# Altium schematic sheet P1.schdoc
size 297 x 209 mm; Symbol: Drawing-Symbol_A4; Company: 嘉立创EDA; Version: V1.0; Page Size: A4; @Project Name: Arduino Serial OLED Terminal_2026-07-03_17-05-52; @Page Count: 1; @Update Date: 2026-07-03; @Create Date: 2026-07-03; @Schematic Name: Schematic1; @Page No: 1; @Page Name: P1; @Board Name: Board1; @Create Time: 09:07:05; @Update Time: 17:07:05; Border: 1; Title Block Position: 3; Size: A4; Width: 1170; Height: 825; Region Start: 1; X Region Count: 6; Y Region Count: 4; Blade Width: 10; Device: Drawing-Symbol_A4
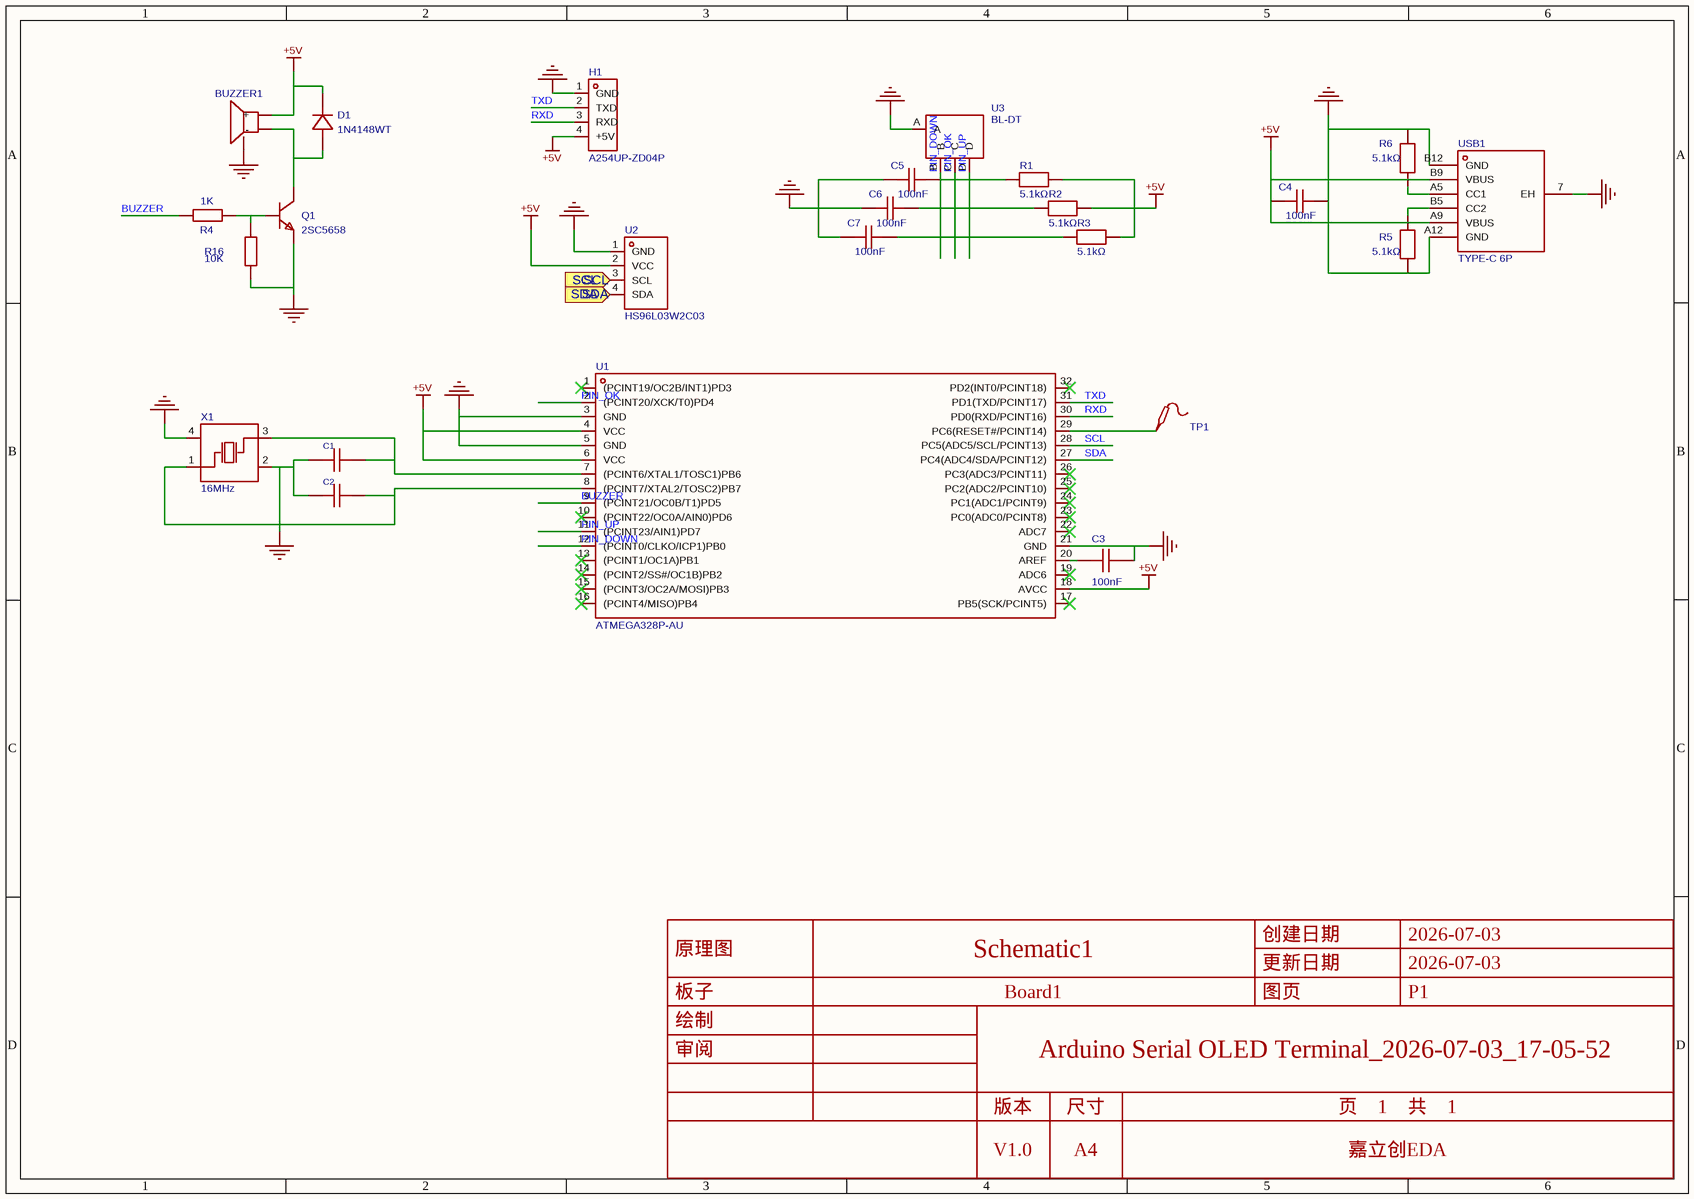
[diagram p0: P1.schdoc]

## Parts
BUZZER1  4kHz  [BUZ-SMD_L5.0-W5.5-P4.60]  (value not drawn)
C1  CL10C220JB8NNNC  [C0603]  (value not drawn)
C2  CL10C220JB8NNNC  [C0603]  (value not drawn)
C3  100nF  [C0603]
C4  100nF  [C0603]
C5  100nF  [C0603]
C6  100nF  [C0603]
C7  100nF  [C0603]
D1  1N4148WT  [SOD-523_L1.2-W0.8-LS1.6-FD]
H1  A254UP-ZD04P  [HDR-TH_A254UP-ZD04P]
Q1  2SC5658  [SOT-723_L1.2-W0.8-P0.80-LS1.2-BR]
R1  5.1kΩ  [R0603]
R2  5.1kΩ  [R0603]
R3  5.1kΩ  [R0603]
R4  1K  [R0402_无丝印]
R5  5.1kΩ  [R0603]
R6  5.1kΩ  [R0603]
R16  10K  [R0402_无丝印]
TP1  (no value)  [Test-Point-0.5mm]
U1  ATMEGA328P-AU  [TQFP-32_L7.0-W7.0-P0.80-LS9.0-BL]
U2  HS96L03W2C03  [OLED-TH_L27.8-W27.2-P2.54_C9900033791]
U3  BL-DT  [SW-SMD_BL-DT]
USB1  TYPE-C 6P  [TYPE-C-SMD_TYPE-C-6P_1]
X1  16MHz  [CRYSTAL-SMD_4P-L3.2-W2.5-BL]

## Ports
SCL (in), SDA (in)

## Nets
+5V: BUZZER1.1(+) C4.1 D1.2(C) H1.4(+5V) R1.2 R2.2 R3.2 U1.4(VCC) U1.6(VCC) U1.18(AVCC) U2.2(VCC) USB1.A9(VBUS) USB1.B9(VBUS)
GND: BUZZER1.3(NC) C1.1 C2.1 C3.2 C4.2 C5.1 C6.1 C7.1 H1.1(GND) Q1.2(E) R5.1 R6.2 R16.1 U1.3(GND) U1.5(GND) U1.21(GND) U2.1(GND) U3.A USB1.7(EH) USB1.A12(GND) USB1.B12(GND) X1.2(GND) X1.4(GND)
BUZZER: R4.1 U1.9((PCINT21/OC0B/T1)PD5)
PIN_DOWN: C5.2 R1.1 U1.12((PCINT0/CLKO/ICP1)PB0) U3.B
PIN_OK: C6.2 R2.1 U1.2((PCINT20/XCK/T0)PD4) U3.C
PIN_UP: C7.2 R3.1 U1.11((PCINT23/AIN1)PD7) U3.D
RXD: H1.3(RXD) U1.30(PD0(RXD/PCINT16))
SCL: U1.28(PC5(ADC5/SCL/PCINT13)) U2.3(SCL) ; port SCL
SDA: U1.27(PC4(ADC4/SDA/PCINT12)) U2.4(SDA) ; port SDA
TXD: H1.2(TXD) U1.31(PD1(TXD/PCINT17))
NetBUZZER1_2: BUZZER1.2(-) D1.1(A) Q1.3(C)
NetC1_2: C1.2 U1.7((PCINT6/XTAL1/TOSC1)PB6) X1.3(OSC2)
NetC2_2: C2.2 U1.8((PCINT7/XTAL2/TOSC2)PB7) X1.1(OSC1)
NetC3_1: C3.1 U1.20(AREF)
NetQ1_1: Q1.1(B) R4.2 R16.2
NetR5_2: R5.2 USB1.B5(CC2)
NetR6_1: R6.1 USB1.A5(CC1)
NetTP1_1: TP1.1 U1.29(PC6(RESET#/PCINT14))

Not connected (* = marked no-connect by the designer): U1 1((PCINT19/OC2B/INT1)PD3)* 10((PCINT22/OC0A/AIN0)PD6)* 13((PCINT1/OC1A)PB1)* 14((PCINT2/SS#/OC1B)PB2)* 15((PCINT3/OC2A/MOSI)PB3)* 16((PCINT4/MISO)PB4)* 17(PB5(SCK/PCINT5))* 19(ADC6)* 22(ADC7)* 23(PC0(ADC0/PCINT8))* 24(PC1(ADC1/PCINT9))* 25(PC2(ADC2/PCINT10))* 26(PC3(ADC3/PCINT11))* 32(PD2(INT0/PCINT18))*

## Notes on the sheet
- 创建日期
- 2026-07-03
- 原理图
- 板子
- Schematic1
- Board1
- 更新日期
- 图页
- P1
- 绘制
- 审阅
- Arduino Serial OLED Terminal_2026-07-03_17-05-52
- 版本
- V1.0
- 尺寸
- A4
- 页    1    共    1
- 嘉立创EDA

## Library data of the parts
BUZZER1 = MLT-5020: Manufacturer: 华能; Driver Circuitry: 无源(外部驱动); 3D Model: 0044e78390e14de39818311c3b0a8804; 3D Model Transform: 207.31557,204.724,0,270,0,0,-0.001,0.003,0; AddInBom: yes; ModelName: BUZ-SMD_3P-L5.2-W5.2-H2.0-P3.50; Symbol: MLT-5020; Device: MLT-5020; LCSC Part Name: MLT-5020; Supplier Part: C94598; Manufacturer Part: MLT-5020; Supplier Footprint: SMD,5x5mm; JLCPCB Part Class: 扩展库; Datasheet: https://atta.szlcsc.com/upload/public/pdf/source/20210811/111454390007D221D7259018FB170E62.pdf; Supplier: LCSC; Technology: 电磁式; Value: 4kHz; Length: 5.2mm; Width: 5.2mm; Height: 2.5mm; FootprintName: BUZ-SMD_L5.0-W5.5-P4.60; ConvertToPcb: yes
C1 C2 = CL10C220JB8NNNC: 容值:22pF;精度:±5%;额定电压:50V;温度系数:C0G;; Manufacturer: SAMSUNG(三星); AddInBom: yes; ModelId: ac125912035d415993ca9572d50418b1; ModelName: C0603_L1.6-W0.8-H0.8; ModelTransform: 62.992,31.496,0,0,0,0,0,0,0; Value: 22pF; Tolerance: ±5%; Voltage Rating: 50V; Temperature Coefficient: C0G; Device: CL10C220JB8NNNC; LCSC Part Name: 22pF ±5% 50V; SupplierPart: C1653; ManufacturerPart: CL10C220JB8NNNC; Supplier Footprint: 0603; JLCPCB Part Class: 基础库; Datasheet: https://item.szlcsc.com/datasheet/CL10C220JB8NNNC/2005.html; Supplier: LCSC; ConvertToPcb: yes; SymbolName: CL10C220JB8NNNC; FootprintName: C0603
C3 = FCC0603B104K500CT: 容值:100nF;精度:±10%;额定电压:50V;温度系数:X7R;; Manufacturer: FOJAN(富捷); AddInBom: yes; ModelId: ac125912035d415993ca9572d50418b1; ModelName: C0603_L1.6-W0.8-H0.8; ModelTransform: 62.992,31.496,0,0,0,0,0,0,0; Tolerance: ±10%; Voltage Rating: 50V; Temperature Coefficient: X7R; Symbol: FCC0603B104K500CT; Device: FCC0603B104K500CT; LCSC Part Name: 100nF ±10% 50V; SupplierPart: C5137636; ManufacturerPart: FCC0603B104K500CT; Supplier Footprint: 0603; JLCPCB Part Class: 扩展库; Datasheet: https://item.szlcsc.com/datasheet/FCC0603B104K500CT/5747088.html; Supplier: LCSC; ConvertToPcb: yes; FootprintName: C0603; Value: 100nF
C4-C7 = FCC0603B104K500CT: 容值:100nF;精度:±10%;额定电压:50V;温度系数:X7R;; Manufacturer: FOJAN(富捷); 3D Model: ac125912035d415993ca9572d50418b1; 3D Model Transform: 62.992,31.496,0,0,0,0,0,0,0; Tolerance: ±10%; Voltage Rating: 50V; Temperature Coefficient: X7R; AddInBom: yes; ModelName: C0603_L1.6-W0.8-H0.8; Symbol: FCC0603B104K500CT; Device: FCC0603B104K500CT; LCSC Part Name: 100nF ±10% 50V; Supplier Part: C5137636; Manufacturer Part: FCC0603B104K500CT; Supplier Footprint: 0603; JLCPCB Part Class: 扩展库; Datasheet: https://item.szlcsc.com/datasheet/FCC0603B104K500CT/5747088.html; Supplier: LCSC; Value: 100nF; ConvertToPcb: yes; FootprintName: C0603
D1 = 1N4148WT_C2961218: Manufacturer: CJ(江苏长电/长晶); Diode Configuration: 独立式; Forward Voltage (Vf@If): 1.25V@150mA; Reverse Voltage (Vr): 75V; Rectified Current: 150mA; Reverse Leakage Current (Ir): 1uA@75V; Reverse Recovery Time (trr): 4ns; 3D Model: 8f56a03db567494d8f4c9d12aa52a741; 3D Model Transform: 62.992,31.496,0,0,0,0,0,0,0; AddInBom: yes; ModelName: SOD-523_L1.2-W0.8-H0.7-LS1.6; Symbol: 1N4148WT_C2961218; Device: 1N4148WT_C2961218; LCSC Part Name: 1N4148WT; Supplier Part: C2961218; Manufacturer Part: 1N4148WT; Supplier Footprint: SOD-523; JLCPCB Part Class: 扩展库; Datasheet: https://atta.szlcsc.com/upload/public/pdf/source/20220119/078E246DE0AEC70DDF429D96EB20929E.pdf; Supplier: LCSC; Operating Temperature: -55℃~+150℃@(Tj); FootprintName: SOD-523_L1.2-W0.8-LS1.6-FD; ConvertToPcb: yes
H1 = A254UP-ZD04P: 插针结构:1x4P;间距:2.54mm;行距:-;圆针/方针:方针;安装方式:直插;排数:单排;总PIN位数:4P;额定电流:3A;配合针长度:6mm;塑高:2.5mm;触头材质:黄铜;触头镀层:金;工作温度:-40℃~+105℃;颜色:黑色;; Manufacturer: BXCONN(宝讯); AddInBom: yes; ModelId: 55ae819b25fc49c39c917541034744cf0819f05c4eef4c71ace90d822a990e87; ModelTransform: 400.3929,98.425,0,0,0,0,0,0,-118.11; Pin Structure: 1x4P; Pitch: 2.54mm; Circluar Pins/Square Pins: 方针; Current Rating: 3A; Symbol: A254UP-ZD04P; Device: A254UP-ZD04P; LCSC Part Name: 1x4P 间距:2.54mm 方针 直插; SupplierPart: C41413833; ManufacturerPart: A254UP-ZD04P; Supplier Footprint: 插件,P=2.54mm; JLCPCB Part Class: Extended Part; Datasheet: https://item.szlcsc.com/datasheet/A254UP-ZD04P/43230040.html; Supplier: LCSC; ConvertToPcb: yes; FootprintName: HDR-TH_A254UP-ZD04P; ModelName: HDR-TH_A254UP-ZD04P; Row Spacing: -; Mounting Type: 直插; Number of Rows: 单排; Number of Pins: 4P; Length of Mating Pin: 6mm; Insulation Height: 2.5mm; Contact Material: 黄铜; Contact Plating: 金; Operating Temperature: -40℃~+105℃; Color: 黑色
Q1 = 2SC5658: Manufacturer: CJ(江苏长电/长晶); type: NPN; Current - Collector(Ic): 150mA; Collector - Emitter Voltage VCEO: 50V; Pd - Power Dissipation: 100mW; DC Current Gain: 120@1mA,6V; Transition frequency(fT): 180MHz; Current - Collector Cutoff: 100nA; Vce Saturation(VCE(sat)): 400mV; 3D Model: 8f70d69c83f742259d42411b19cb5a39; 3D Model Transform: 47.244,47.244,0,0,0,0,0,0,0; AddInBom: yes; Symbol: 2SC5658; Device: 2SC5658; LCSC Part Name: 2SC5658; Supplier Part: C2991944; Manufacturer Part: 2SC5658; Supplier Footprint: SOT-723-3; JLCPCB Part Class: 扩展库; Datasheet: https://atta.szlcsc.com/upload/public/pdf/source/20220411/B0F88ECFC7B48FCE56684AE93078BF46.pdf; Supplier: LCSC; Operating Temperature: -55℃~+150℃; FootprintName: SOT-723_L1.2-W0.8-P0.80-LS1.2-BR; ConvertToPcb: yes; ModelName: SOT-723_L1.2-W0.8-P0.80-LS1.2-BR
R1-R3 = FRC0603F5101TS: 电阻类型:厚膜电阻;阻值:5.1kΩ;精度:±1%;功率:100mW;工作电压:75V;温度系数:±100ppm/℃;; Manufacturer: FOJAN(富捷); AddInBom: yes; ModelId: fc143cca1e79419f9cd78b61e9279f080819f05c4eef4c71ace90d822a990e87; ModelTransform: 31.8897,63.7794,0,90,0,0,0,0,0; Tolerance: ±1%; Power(Watts): 100mW; Voltage-Supply(Max): 75V; Symbol: FRC0603F5101TS; Device: FRC0603F5101TS; LCSC Part Name: 5.1kΩ ±1% 100mW 厚膜电阻; SupplierPart: C2907044; ManufacturerPart: FRC0603F5101TS; Supplier Footprint: 0603; JLCPCB Part Class: Extended Part; Supplier: LCSC; ConvertToPcb: yes; FootprintName: R0603; ModelName: R0603; Type: 厚膜电阻; Value: 5.1kΩ; Temperature Coefficient: ±100ppm/℃; Operating Temperature: -55℃~+155℃
R4 R16 = R0402_无丝印: 3D Model: 98c88bc2b9094f218f3a3e30a7012738; 3D Model Transform: 39.37,19.685,14.1732,0,0,0,1200.6299,272.6969,0; AddInBom: yes; ModelName: R0402_L1.0-W0.5-H0.4; Symbol: R0402_无丝印; Device: R0402_无丝印; FootprintName: R0402_无丝印; ConvertToPcb: yes
R5 R6 = FRC0603F5101TS: 电阻类型:厚膜电阻;阻值:5.1kΩ;精度:±1%;功率:100mW;工作电压:75V;温度系数:±100ppm/℃;; Manufacturer: FOJAN(富捷); 3D Model: fc143cca1e79419f9cd78b61e9279f080819f05c4eef4c71ace90d822a990e87; 3D Model Transform: 31.8897,63.7794,0,90,0,0,0,0,0; Tolerance: ±1%; Power(Watts): 100mW; Voltage-Supply(Max): 75V; AddInBom: yes; Symbol: FRC0603F5101TS; Device: FRC0603F5101TS; LCSC Part Name: 5.1kΩ ±1% 100mW 厚膜电阻; Supplier Part: C2907044; Manufacturer Part: FRC0603F5101TS; Supplier Footprint: 0603; JLCPCB Part Class: Extended Part; Supplier: LCSC; Type: 厚膜电阻; Value: 5.1kΩ; Temperature Coefficient: ±100ppm/℃; Operating Temperature: -55℃~+155℃; ConvertToPcb: yes; FootprintName: R0603; ModelName: R0603
TP1 = Test-Point: Test Point 测试点; AddInBom: yes; Symbol: Test-Point; Device: Test-Point; ConvertToPcb: yes; FootprintName: Test-Point-0.5mm
U1 = ATMEGA328P-AU: CPU内核:AVR;CPU最大主频:20MHz;CPU位数:8 Bit;; Manufacturer: MICROCHIP(美国微芯); AddInBom: yes; ModelId: 2f509107a7a846499a7beaa4f6ecf97b; ModelName: TQFP-32_L7.0-W7.0-H1.2-LS9.0-P0.80; ModelTransform: 354.98382,354.98386,0,90,0,0,-0.039,0.079,0; CPU Core: AVR; CPU Maximum Speed: 20MHz; Core Size: 8 Bit; Program Storage Size: 32KB; Program Memory Type: FLASH; RAM Size: 2KB; EEPROM: 1KB; Number of I/O: 23; ADC (Bit): 10bit; Oscillator Type: 内置; Voltage - Supply: 1.8V~5.5V; Symbol: ATMEGA328P-AU; Device: ATMEGA328P-AU; LCSC Part Name: 基于AVR增强型RISC架构的低功耗CMOS 8位微控制器; SupplierPart: C14877; ManufacturerPart: ATMEGA328P-AU; Supplier Footprint: TQFP-32(7x7); JLCPCB Part Class: 扩展库; Datasheet: https://item.szlcsc.com/datasheet/ATMEGA328P-AU/15549.html; Supplier: LCSC; ConvertToPcb: yes; FootprintName: TQFP-32_L7.0-W7.0-P0.80-LS9.0-BL; Operating Temperature: -40℃~+85℃; Features: 外部管脚复位(NRST)；内置通用定时器；上电复位(POR)；触控功能；欠压检测(BOR/LVD/LVR/LVI)；可编程看门狗
U2 = HS96L03W2C03: 核心芯片:SSD1315芯片;接口类型:I2C;尺寸(inch):0.96;像素分辨率:128x64;; Manufacturer: HS(汉昇); Symbol: HS96L03W2C03_1; 3D Model: bb65183306db4ca69fb52250be49b00e; 3D Model Transform: 1070.864,1094.486,0,0,0,0,0,-498.424,0; Interface: I2C; Dot Pixels: 128x64; Type of Drive: 无源(PMOLED); Display Range: 21.744x10.864mm; Display Color: 白色; Luminance: 180cd/m2; AddInBom: yes; Device: HS96L03W2C03; LCSC Part Name: 0.96寸OLED显示屏窄白光IIC; Supplier Part: C5248080; Manufacturer Part: HS96L03W2C03; Supplier Footprint: -; JLCPCB Part Class: 扩展库; Datasheet: https://item.szlcsc.com/datasheet/HS96L03W2C03/5960631.html; Supplier: LCSC; Controller Type: SSD1315芯片; Size: 0.96; Operating Temperature: -40℃~+70℃; Function: -; Quiescent Current: -; ConvertToPcb: yes; FootprintName: OLED-TH_L27.8-W27.2-P2.54_C9900033791; ModelName: OLED-TH_L27.8-W27.2-P2.54_C9900033791
U3 = BL-DT: 复位二档，3脚贴片大头拨轮开关; Manufacturer: SHOU HAN(首韩); AddInBom: yes; Whether to Press Down: 支持; Toggle reset: 自复位; Voltage Rating: 12V; Symbol: BL-DT; Device: BL-DT; LCSC Part Name: 大头拨轮开关; SupplierPart: C53223909; ManufacturerPart: BL-DT; Supplier Footprint: SMD; JLCPCB Part Class: Extended Part; Datasheet: https://item.szlcsc.com/datasheet/BL-DT/56266931.html; Supplier: LCSC; ConvertToPcb: yes; FootprintName: SW-SMD_BL-DT; Mounting Type: 卧贴; Operating Temperature: -10℃~+60℃
USB1 = TYPE-C 6P: 连接器类型:Type-C;协议标准:-;公母:母;安装方式:卧贴;触点数量:6P;端口数量:1;额定电流 - 电源:3A;工作温度:-40℃~+85℃;; Manufacturer: SHOU HAN(首韩); AddInBom: yes; ModelId: c676c28a9ced4874b57ea285c41c51820819f05c4eef4c71ace90d822a990e87; ModelName: TYPE-C-SMD_6P-L8.9-W6.8-H3.2-P1.00; ModelTransform: 351.9678,267.716,0,180,0,0,0,-48.226,-39.37; Gender: 母; Number of Ports: 1; Current Rating-Power: 3A; Voltage Rating: 5V; Connect-Disconnect Life: 3千次; Detection color: 黑色; Symbol: TYPE-C 6P; Device: TYPE-C 6P; LCSC Part Name: 6P卧贴母座; SupplierPart: C456012; ManufacturerPart: TYPE-C 6P; Supplier Footprint: SMD; JLCPCB Part Class: Extended Part; Datasheet: https://item.szlcsc.com/datasheet/TYPE-C%25206P/458819.html; Supplier: LCSC; ConvertToPcb: yes; FootprintName: TYPE-C-SMD_TYPE-C-6P_1; Connector Type: Type-C; Protocol Standard: -; Mounting Type: 卧贴; Number of Contacts: 6P; Supplementary Features: -; Center Height: -; Length: -; Operating Temperature: -40℃~+85℃
X1 = X322516MLB4SI: 晶振类型:贴片晶振;频率:16MHz;常温频差:±10ppm;负载电容:9pF;频率稳定度:±20ppm;; Manufacturer: YXC(扬兴晶振); AddInBom: yes; ModelId: ff2dfd5650294453a14147960efe1838; ModelTransform: 125.984,98.425,0,0,0,0,0,0,0; Normal temperature Frequency Tolerance: ±10ppm; Load Capacitance: 9pF; Frequency Stability: ±20ppm; Symbol: X322516MLB4SI; Device: X322516MLB4SI; LCSC Part Name: YSX321SL 16MHZ 4P 3225 9PF ±10PPM -40~85℃ (±20PPM); SupplierPart: C13738; ManufacturerPart: X322516MLB4SI; Supplier Footprint: SMD3225-4P; JLCPCB Part Class: 基础库; Datasheet: https://item.szlcsc.com/datasheet/X322516MLB4SI/14393.html; Supplier: LCSC; ConvertToPcb: yes; FootprintName: CRYSTAL-SMD_4P-L3.2-W2.5-BL; ModelName: CRYSTAL-SMD_4P-L3.2-W2.5-BL; Type: 贴片晶振; Value: 16MHz; Operating Temperature: -40℃~+85℃